# Altium schematic sheet Optos.SchDoc
size A; Organization: Underwater Robotics; Address1: c/o Student Involvement; Address2: Campus Box 7306; Address3: 2016 Cates Ave. Raleigh, NC 27695; Revision: A1; SheetNumber: 3E; SheetTotal: 5E
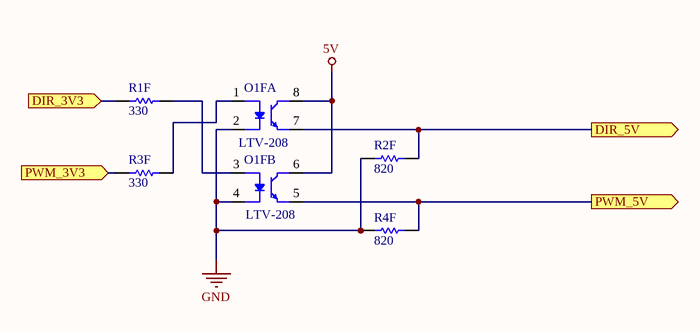
[diagram p0: Optos.SchDoc]

## Parts
O1F  LTV-208  [SSOP8 Lite-on]  (parts A,B of 2)
R1F  value 330  [R0603]  (hidden comment: Resistor)
R2F  value 820  [R0603]  (hidden comment: Resistor)
R3F  value 330  [R0603]  (hidden comment: Resistor)
R4F  value 820  [R0603]  (hidden comment: Resistor)

## Ports
DIR_3V3 (in), DIR_5V (out), PWM_3V3 (in), PWM_5V (out)

## Nets
5V: O1F.6 O1F.8
GND: O1F.2 O1F.4 R2F.2 R4F.2
DIR_3V3: R1F.1 ; port DIR_3V3
DIR_5V: O1F.7 R2F.1 ; port DIR_5V
PWM_3V3: R3F.1 ; port PWM_3V3
PWM_5V: O1F.5 R4F.1 ; port PWM_5V
NetO1F_1: O1F.1 R3F.2
NetO1F_3: O1F.3 R1F.2

## Notes on the sheet
- Title
- Size:
- Date:
- A
- Number:
- Time:
- Revision:
- Sheet
- of
- File:

## Library data of the parts
O1F = LTV-208, 3.75KV: 2 Channel Optoisolator; Manufacturer 1: Lite-On Inc.; Description 1: OPTOISO 3.75KV 2CH TRANS 8-SOP; Number of Channels: 2; Voltage - Isolation: 3750Vrms; Current Transfer Ratio (Min): 160% @ 10mA; Current Transfer Ratio (Max): 320% @ 10mA; Turn On / Turn Off Time (Typ): 5µs, 4µs; Input Type: DC; Output Type: Transistor; Voltage - Output (Max): 80V; Voltage - Forward (Vf) (Typ): 1.2V; Current - DC Forward (If) (Max): 30mA; Vce Saturation (Max): 400mV; Supplier 1: Digi-Key; Supplier Part Number 1: 160-2067-1-ND; RoHS: RoHS Compliant; Category: Isolators; Stock 1: 1743; Pricing 1: 1=1.24, 10=0.99, 100=0.6875, 250=0.605, 500=0.50876, 1000=0.44 (USD); Packaging: Cut Tape (CT); Rise / Fall Time (Typ): -; Current - Output / Channel: -; Operating Temperature: -55°C ~ 110°C; Mounting Type: Surface Mount; Package / Case: 8-SOIC (0.154", 3.90mm Width); Supplier Device Package: 8-SOP; ComponentLink1URL: http://media.digikey.com/pdf/Data%20Sheets/Lite-On%20PDFs/LTV-20x.pdf; ComponentLink1Description: http://media.digikey.com/pdf/Data%20Sheets/Lite-On%20PDFs/LTV-20x.pdf; Manufacturer Part Number: LTV-208
R1F R3F = 330, 5%, 100mW, Yageo, R0603: Manufacturer 1: YAGEO; Manufacturer Part Number: RC0603JR-07330RL; Tolerance: 1%; Description 1: YAGEO - RC0603JR-07330RL - RES, THICK FILM, 330R, 5%, 0.1W, 0603; Product Range: RC Series; Power Rating: 100; Resistance Tolerance: 5%; Voltage Rating: 50; Resistor Case Style: 0603 [1608 Metric]; Body Width: 0.8; Supplier 1: Newark; Supplier Part Number 1: 68R0184; RoHS: YESX; Stock 1: 4027; Pricing 1: 1=0.002, 10=0.002, 25=0.002, 100=0.002, 250=0.002, 1000=0.002 (USD); Resistance: 330; Packaging: Cut Tape; MSL: -; ComponentLink1URL: http://past.yageo.com/pdf/PYu-R_Packing_6.pdf; ComponentLink1Description: http://past.yageo.com/pdf/PYu-R_Packing_6.pdf; ComponentLink2URL: http://www.farnell.com/cad/1538940.zip; ComponentLink2Description: http://www.farnell.com/cad/1538940.zip; ComponentLink3URL: http://www.farnell.com/datasheets/1868787.pdf; ComponentLink3Description: http://www.farnell.com/datasheets/1868787.pdf; ComponentLink4URL: http://www.yageo.com/pdf/PYu-RC0603_51_RoHS_L_4.pdf; ComponentLink4Description: http://www.yageo.com/pdf/PYu-RC0603_51_RoHS_L_4.pdf
R2F R4F = 820, 5%, 100mW, Yageo, R0603: Manufacturer 1: YAGEO; Manufacturer Part Number: RC0603JR-07820RL; Tolerance: 1%; Description 1: YAGEO - RC0603JR-07820RL - RES, THICK FILM, 820R, 5%, 0.1W, 0603; Product Range: RC Series; Power Rating: 100; Resistance Tolerance: 5%; Voltage Rating: 50; Resistor Case Style: 0603 [1608 Metric]; Body Width: 0.8; Supplier 1: Newark; Supplier Part Number 1: 68R0212; RoHS: YESX; Stock 1: 17122; Pricing 1: 1=0.001, 10=0.001, 25=0.001, 100=0.001, 250=0.001, 1000=0.001 (USD); Resistance: 820; Packaging: Cut Tape; MSL: -; ComponentLink1URL: http://past.yageo.com/pdf/PYu-R_Packing_6.pdf; ComponentLink1Description: http://past.yageo.com/pdf/PYu-R_Packing_6.pdf; ComponentLink2URL: http://www.farnell.com/cad/1539003.zip; ComponentLink2Description: http://www.farnell.com/cad/1539003.zip; ComponentLink3URL: http://www.farnell.com/datasheets/1868787.pdf; ComponentLink3Description: http://www.farnell.com/datasheets/1868787.pdf; ComponentLink4URL: http://www.yageo.com/pdf/PYu-RC0603_51_RoHS_L_4.pdf; ComponentLink4Description: http://www.yageo.com/pdf/PYu-RC0603_51_RoHS_L_4.pdf